# Altium schematic sheet CAN-POWER-B2B.SchDoc
size A; SheetNumber: 3; SheetTotal: 5
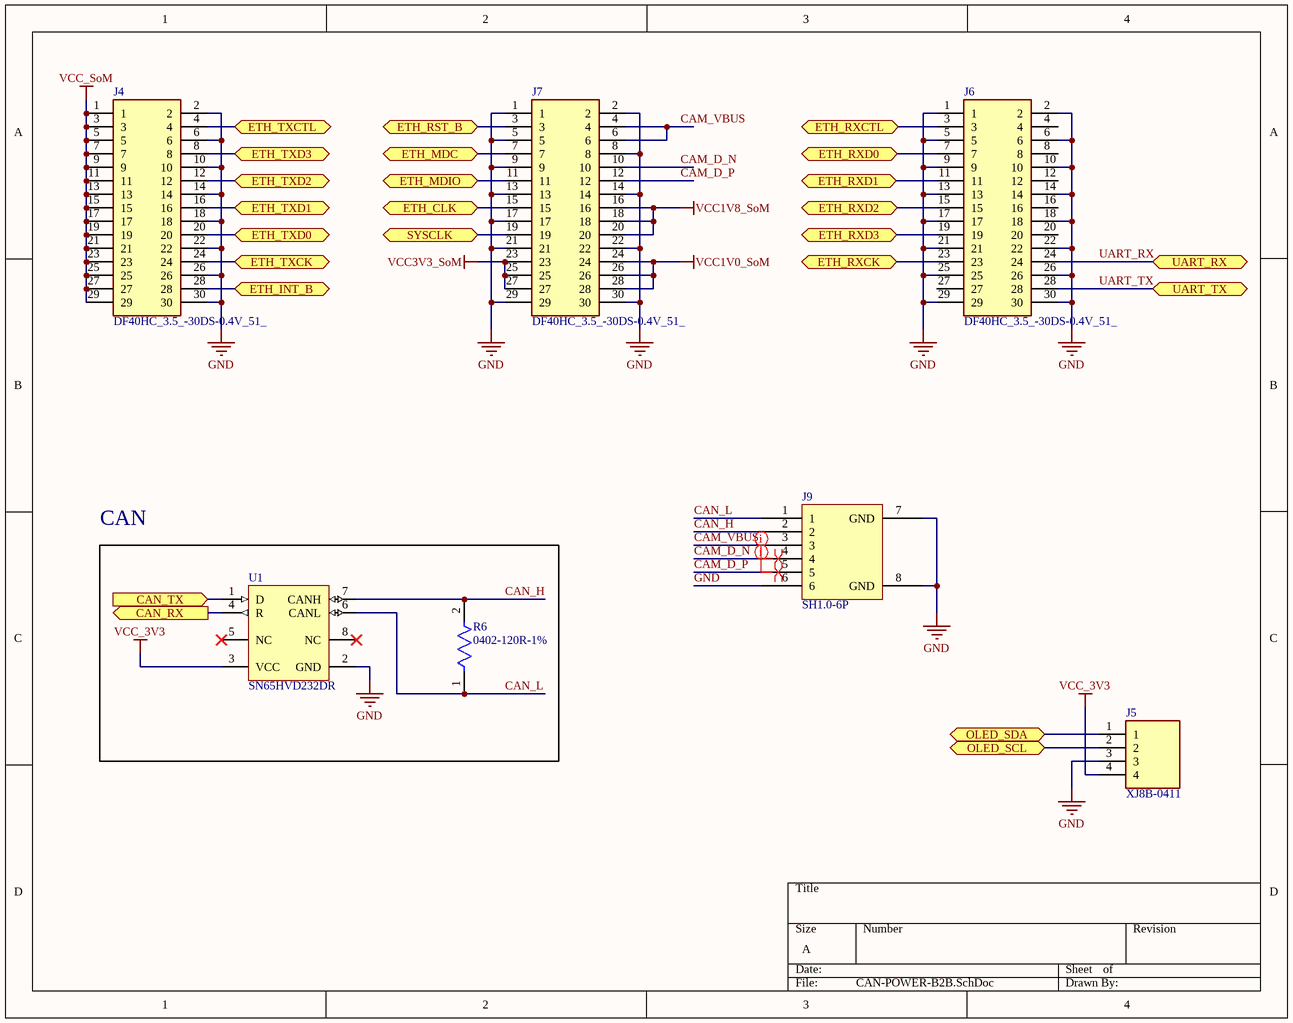
[diagram p0: CAN-POWER-B2B.SchDoc]

## Parts
J4  DF40HC_3.5_-30DS-0.4V_51_  [DF40HC3530DS04V51]
J5  XJ8B-0411  [HDRV4W64P0X254_1X4_1020X250X580P]
J6  DF40HC_3.5_-30DS-0.4V_51_  [DF40HC3530DS04V51]
J7  DF40HC_3.5_-30DS-0.4V_51_  [DF40HC3530DS04V51]
J9  SH1.0-6P  [SH1.0-6P]
R6  0402-120R-1%  [FP-CRCW0402-e3-IPC_C]
U1  SN65HVD232DR  [D0008A_M]

## Blocks framed on the sheet
CAN: R6 U1

## Ports
CAN_RX (out, see ESP32[3B]), CAN_TX (in, see ESP32[3B]), ETH_CLK (bidir, see Ethernet-PHY[1A]), ETH_INT_B (bidir, see Ethernet-PHY[1C]), ETH_MDC (bidir, see Ethernet-PHY[2B]), ETH_MDIO (bidir, see Ethernet-PHY[2B]), ETH_RST_B (bidir, see Ethernet-PHY[2B]), ETH_RXCK (bidir, see Ethernet-PHY[2D]), ETH_RXCTL (bidir, see Ethernet-PHY[2D]), ETH_RXD0 (bidir, see Ethernet-PHY[2D]), ETH_RXD1 (bidir, see Ethernet-PHY[2D]), ETH_RXD2 (bidir, see Ethernet-PHY[2D]), ETH_RXD3 (bidir, see Ethernet-PHY[2D]), ETH_TXCK (bidir, see Ethernet-PHY[2C]), ETH_TXCTL (bidir, see Ethernet-PHY[2C]), ETH_TXD0 (bidir, see Ethernet-PHY[2C]), ETH_TXD1 (bidir, see Ethernet-PHY[2C]), ETH_TXD2 (bidir, see Ethernet-PHY[2C]), ETH_TXD3 (bidir, see Ethernet-PHY[2C]), OLED_SCL (bidir, see ESP32[3B]), OLED_SDA (bidir, see ESP32[3B]), SYSCLK (bidir, see Ethernet-PHY[1A]), UART_RX (bidir, see ESP32[3B]), UART_TX (bidir, see ESP32[2B])

## Nets
GND: J4.2 J4.6 J4.10 J4.14 J4.18 J4.22 J4.26 J4.30 J5.3 J6.1 J6.2 J6.5 J6.6 J6.9 J6.10 J6.13 J6.14 J6.17 J6.18 J6.21 J6.22 J6.25 J6.26 J6.29 J6.30 J7.1 J7.2 J7.5 J7.8 J7.9 J7.13 J7.14 J7.17 J7.21 J7.22 J7.29 J7.30 J9.6 J9.7(GND) J9.8(GND) U1.2(GND)
VCC1V0_SoM: J7.24 J7.26 J7.28
VCC1V8_SoM: J7.16 J7.18 J7.20
VCC3V3_SoM: J7.23 J7.25 J7.27
VCC_3V3: J5.4 U1.3(VCC)
VCC_SoM: J4.1 J4.3 J4.5 J4.7 J4.9 J4.11 J4.13 J4.15 J4.17 J4.19 J4.21 J4.23 J4.25 J4.27 J4.29
CAM_D_N: J7.10 J9.4
CAM_D_P: J7.12 J9.5
CAM_VBUS: J7.4 J7.6 J9.3
CAN_H: J9.2 R6.2 U1.7(CANH)
CAN_L: J9.1 R6.1 U1.6(CANL)
CAN_RX: U1.4(R) ; port CAN_RX
CAN_TX: U1.1(D) ; port CAN_TX
ETH_CLK: J7.15 ; port ETH_CLK
ETH_INT_B: J4.28 ; port ETH_INT_B
ETH_MDC: J7.7 ; port ETH_MDC
ETH_MDIO: J7.11 ; port ETH_MDIO
ETH_RST_B: J7.3 ; port ETH_RST_B
ETH_RXCK: J6.23 ; port ETH_RXCK
ETH_RXCTL: J6.3 ; port ETH_RXCTL
ETH_RXD0: J6.7 ; port ETH_RXD0
ETH_RXD1: J6.11 ; port ETH_RXD1
ETH_RXD2: J6.15 ; port ETH_RXD2
ETH_RXD3: J6.19 ; port ETH_RXD3
ETH_TXCK: J4.24 ; port ETH_TXCK
ETH_TXCTL: J4.4 ; port ETH_TXCTL
ETH_TXD0: J4.20 ; port ETH_TXD0
ETH_TXD1: J4.16 ; port ETH_TXD1
ETH_TXD2: J4.12 ; port ETH_TXD2
ETH_TXD3: J4.8 ; port ETH_TXD3
OLED_SCL: J5.2 ; port OLED_SCL
OLED_SDA: J5.1 ; port OLED_SDA
SYSCLK: J7.19 ; port SYSCLK
UART_RX: J6.24 ; port UART_RX
UART_TX: J6.28 ; port UART_TX

Not connected (* = marked no-connect by the designer): J6 4 8 12 16 20 27; U1 5(NC)* 8(NC)*

## Layout directives
net class CAM_USB: CAM_D_N, CAM_D_P
differential pair: CAM_D_N, CAM_D_P

## Library data of the parts
J4 J6 J7 = DF40HC_3.5_-30DS-0.4V_51_: Connector; Manufacturer_Name: Hirose; Manufacturer_Part_Number: DF40HC(3.5)-30DS-0.4V(51); Datasheet Link: https://www.hirose.com/product/en/products/DF40/DF40HC%283.5%29-30DS-0.4V%2851%29/; Height: 3mm; Mouser Part Number: 798-DF40HC3530DS04V; Mouser Price/Stock: https://www.mouser.co.uk/ProductDetail/Hirose-Connector/DF40HC3.5-30DS-0.4V51?qs=sAMQa04WsV9vLKgcIJF7Vw%3D%3D
J5 = XJ8B-0411: Connector; Manufacturer_Name: Omron Electronics; Datasheet Link: https://www.omron.com/ecb/products/pdf/en-xj8.pdf; Height: 5.8mm; Manufacturer_Part_Number: XJ8B-0411; Mouser Part Number: 653-XJ8B0411; Mouser Price/Stock: https://www.mouser.co.uk/ProductDetail/Omron-Electronics/XJ8B-0411?qs=8ODJmtm206ec9SYet6om8g%3D%3D
R6 = CMP-2002-08122-2: RES Thick Film, 0Ω, 0.063W, 0402; Tolerance: 5%; Max Power Dissipation: 63mW; Voltage Rating: 50V; Temperature Coefficient: 100ppm/°C; Resistance: 0mR; Contact Plating: Tin; Height: 0.35mm; Radiation Hardening: No; Features: Automotive AEC-Q200; Composition: Thick Film; Width: 0.5mm; Weight: 2.3E-05oz; Termination: SMD/SMT; Packaging: Tape and Reel; Mount: Surface Mount; Case Code (Metric): 1005; Military Standard: Not; Min Operating Temperature: -55°C; Number of Terminations: 2; Package Quantity: 1; Case Code (Imperial): 0402; Depth: 0.5mm; Max Operating Temperature: 155°C; Case/Package: 0402; Power Rating: 63mW; Lead Free: Lead Free; Voltage Rating (DC): 50V; Length: 1mm
U1 = CMP-0315-00075-2: 3.3 V Can Transceiver, 17 mA, -40 to 85 degC, 8-pin SOIC (D), Green (RoHS & no Sb/Br); Manufacturer: Texas Instruments; Supply Voltage(s)(V): 3.3; Receivers Per Package: 1; ICC(Max)(mA): 17; Rating: Catalog; Transient Pulse Protection(V): -25 to 25; Mounting Technology: Surface Mount; PartNumber: SN65HVD232DR; Code_JEDEC: MS-012AA; Eco-Plan: Green (RoHS & no Sb/Br); Isolated: No; SubFamily: CAN; Footprint: SN65HVD232; Drivers Per Package: 1; ComponentLink1URL: http://www.ti.com/general/docs/lit/getliterature.tsp?genericPartNumber=SN65HVD232&fileType=pdf; ComponentLink1Description: Datasheet; PackageDescription: 8-Pin Plastic Small Outline Integrated Circuit, 4.9 x 3.9 mm, Pitch 1.27 mm Pitch; PackageReference: D0008A; DatasheetVersion: SLOS346K; PackageVersion: revM, Jun-2011